# Altium project DeltaX_basketball_mikro.PrjPcb
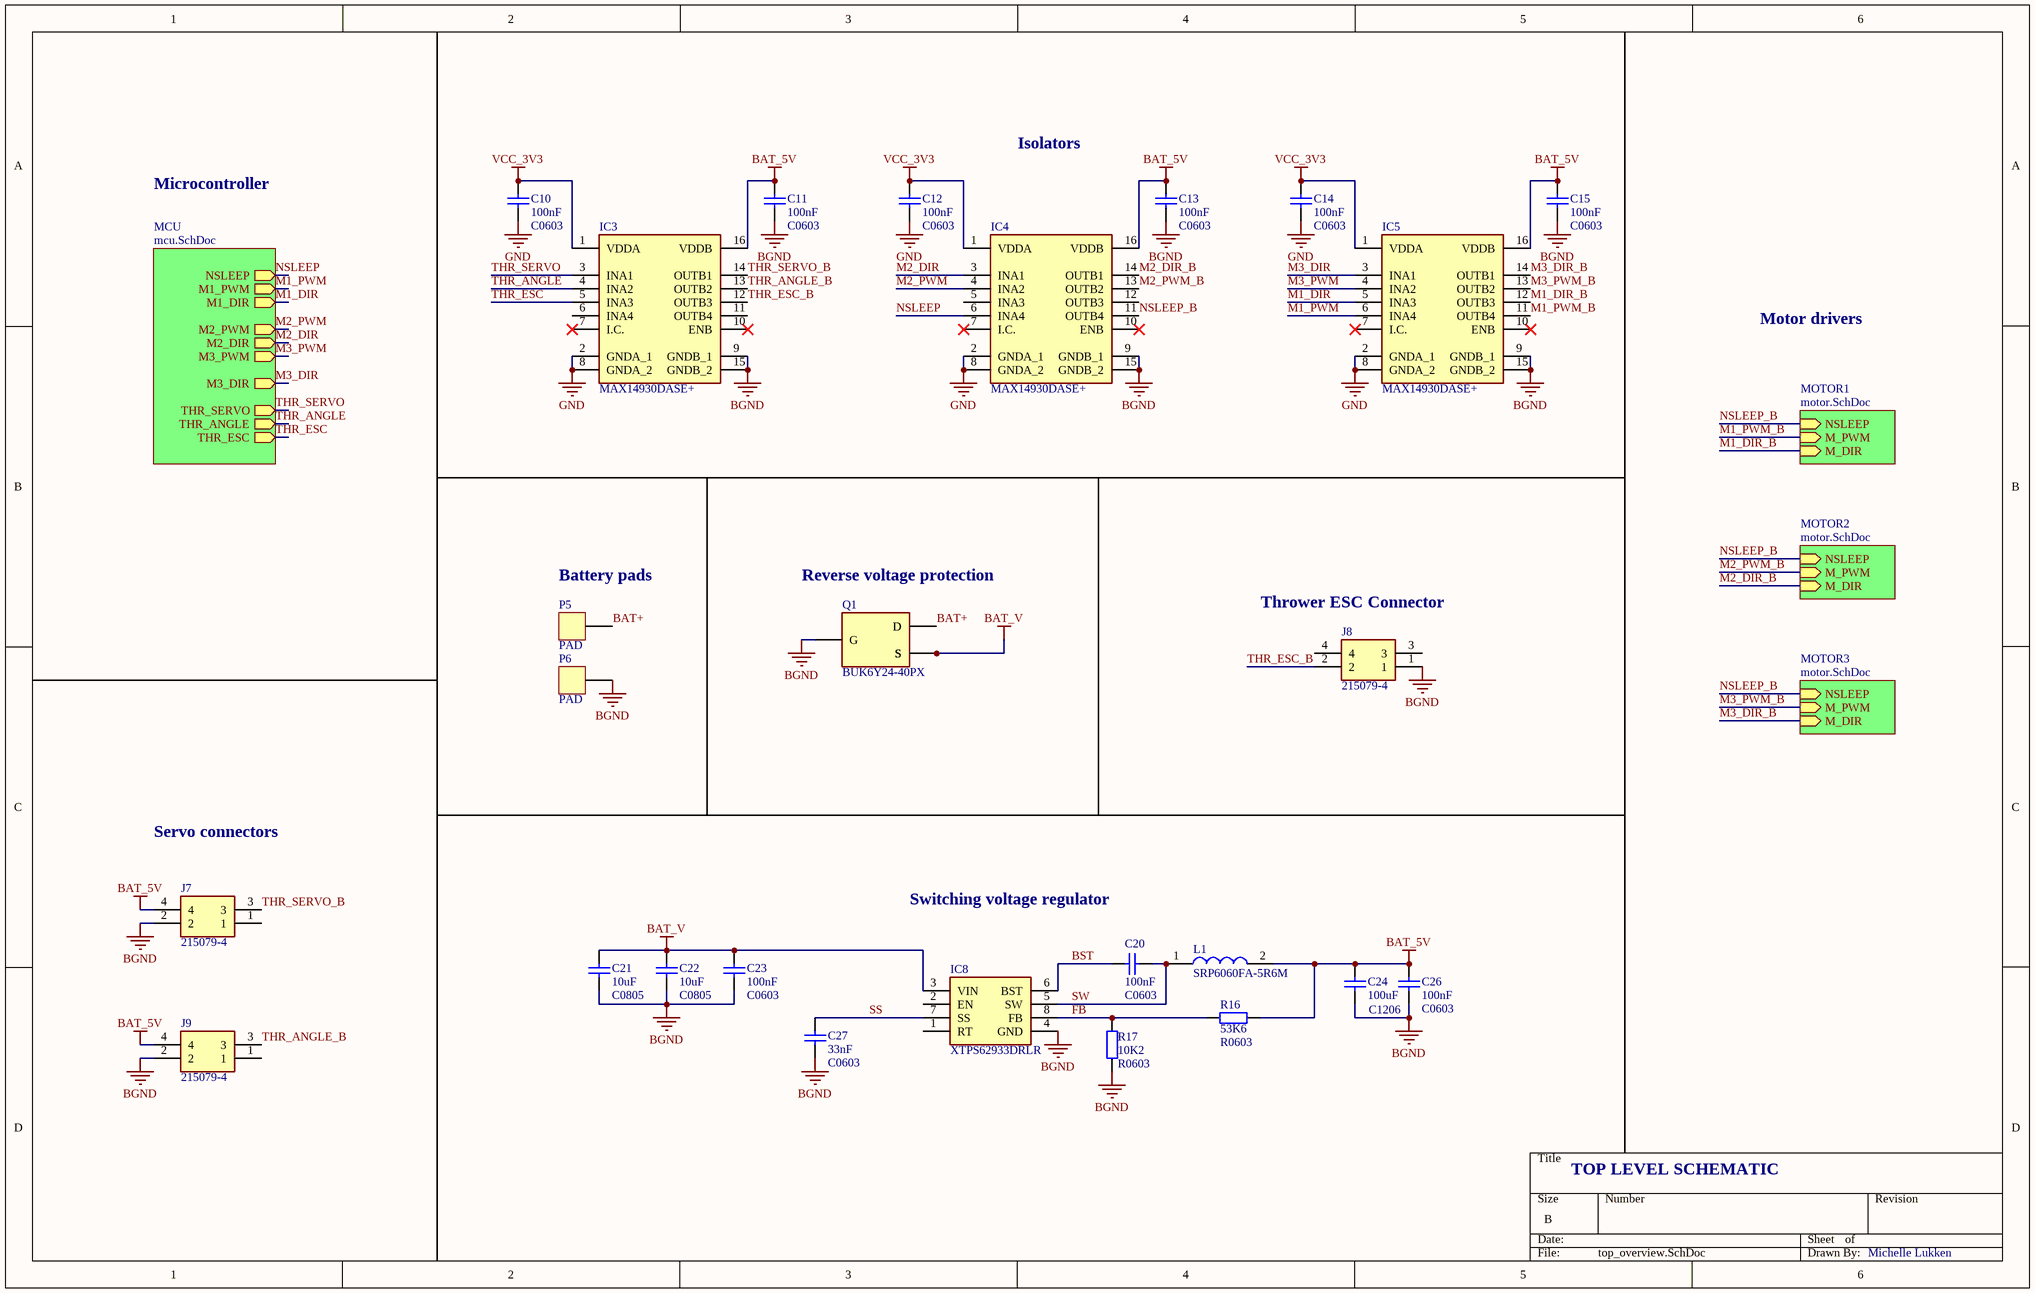
[diagram p0: top_overview.SchDoc]
3 sheets, 89 parts. Net scope: hierarchical (ports join the sheet entries above them; power ports are global).
Board file: mainboard_and_motor_driver_pcb_mu.PcbDoc
Sheets:
  top_overview.SchDoc
    MCU = mcu.SchDoc
    MOTOR1 = motor.SchDoc
    MOTOR2 = motor.SchDoc
    MOTOR3 = motor.SchDoc

## Sheet top_overview.SchDoc
size B; SheetNumber: 1; SheetTotal: 3

### Parts
C10  Capacitance: 100nF  [C0603]
C11  Capacitance: 100nF  [C0603]
C12  Capacitance: 100nF  [C0603]
C13  Capacitance: 100nF  [C0603]
C14  Capacitance: 100nF  [C0603]
C15  Capacitance: 100nF  [C0603]
C20  Capacitance: 100nF  [C0603]
C21  Capacitance: 10uF  [C0805]
C22  Capacitance: 10uF  [C0805]
C23  Capacitance: 100nF  [C0603]
C24  Capacitance: 100uF  [C1206]
C26  Capacitance: 100nF  [C0603]
C27  Capacitance: 33nF  [C0603]
IC3  MAX14930DASE+  [SOIC127P600X175-16N]
IC4  MAX14930DASE+  [SOIC127P600X175-16N]
IC5  MAX14930DASE+  [SOIC127P600X175-16N]
IC8  XTPS62933DRLR  [SOTFL50P160X60-8N]
J7  215079-4  [2150794]
J8  215079-4  [2150794]
J9  215079-4  [2150794]
L1  SRP6060FA-5R6M  [SRP6060FA5R6M]
P5  PAD  [BIG_PAD]
P6  PAD  [BIG_PAD]
Q1  BUK6Y24-40PX  [BUK6Y2440PX]
R16  53K6  [R0603]
R17  10K2  [R0603]

### Sub-sheets
MCU = mcu.SchDoc: M2_DIR (out), M3_PWM (out), M1_PWM (out), M2_PWM (out), M3_DIR (out), M1_DIR (out), NSLEEP (out), THR_SERVO (out), THR_ANGLE (out), THR_ESC (out)
MOTOR1 = motor.SchDoc: NSLEEP (in), M_PWM (in), M_DIR (in)
MOTOR2 = motor.SchDoc: NSLEEP (in), M_PWM (in), M_DIR (in)
MOTOR3 = motor.SchDoc: NSLEEP (in), M_PWM (in), M_DIR (in)

### Nets
BAT_5V: C11.2 C13.2 C15.2 C24.1 C26.1 IC3.16(VDDB) IC4.16(VDDB) IC5.16(VDDB) J7.4 J9.4 L1.2 R16.2
BAT_V: C21.2 C22.2 C23.2 IC8.3(VIN) Q1.1(S) Q1.2(S) Q1.3(S)
BGND: C11.1 C13.1 C15.1 C21.1 C22.1 C23.1 C24.2 C26.2 C27.1 IC3.9(GNDB_1) IC3.15(GNDB_2) IC4.9(GNDB_1) IC4.15(GNDB_2) IC5.9(GNDB_1) IC5.15(GNDB_2) IC8.4(GND) J7.2 J8.1 J9.2 P6.1(PAD) Q1.4(G) R17.2
GND: C10.1 C12.1 C14.1 IC3.2(GNDA_1) IC3.8(GNDA_2) IC4.2(GNDA_1) IC4.8(GNDA_2) IC5.2(GNDA_1) IC5.8(GNDA_2)
VCC_3V3: C10.2 C12.2 C14.2 IC3.1(VDDA) IC4.1(VDDA) IC5.1(VDDA)
BAT+: P5.1(PAD) Q1.5(D) Q1.6(D)
BST: C20.2 IC8.6(BST)
FB: IC8.8(FB) R16.1 R17.1
M1_DIR: IC5.5(INA3) ; sheet MCU/M1_DIR
M1_DIR_B: IC5.12(OUTB3) ; sheet MOTOR1/M_DIR
M1_PWM: IC5.6(INA4) ; sheet MCU/M1_PWM
M1_PWM_B: IC5.11(OUTB4) ; sheet MOTOR1/M_PWM
M2_DIR: IC4.3(INA1) ; sheet MCU/M2_DIR
M2_DIR_B: IC4.14(OUTB1) ; sheet MOTOR2/M_DIR
M2_PWM: IC4.4(INA2) ; sheet MCU/M2_PWM
M2_PWM_B: IC4.13(OUTB2) ; sheet MOTOR2/M_PWM
M3_DIR: IC5.3(INA1) ; sheet MCU/M3_DIR
M3_DIR_B: IC5.14(OUTB1) ; sheet MOTOR3/M_DIR
M3_PWM: IC5.4(INA2) ; sheet MCU/M3_PWM
M3_PWM_B: IC5.13(OUTB2) ; sheet MOTOR3/M_PWM
NSLEEP: IC4.6(INA4) ; sheet MCU/NSLEEP
NSLEEP_B: IC4.11(OUTB4) ; sheet MOTOR1/NSLEEP, sheet MOTOR2/NSLEEP, sheet MOTOR3/NSLEEP
SS: C27.2 IC8.7(SS)
SW: C20.1 IC8.5(SW) L1.1
THR_ANGLE: IC3.4(INA2) ; sheet MCU/THR_ANGLE
THR_ANGLE_B: IC3.13(OUTB2) J9.3
THR_ESC: IC3.5(INA3) ; sheet MCU/THR_ESC
THR_ESC_B: IC3.12(OUTB3) J8.2
THR_SERVO: IC3.3(INA1) ; sheet MCU/THR_SERVO
THR_SERVO_B: IC3.14(OUTB1) J7.3

Not connected (* = marked no-connect by the designer): IC3 6(INA4) 7(I.C.)* 10(ENB)* 11(OUTB4); IC4 5(INA3) 7(I.C.)* 10(ENB)* 12(OUTB3); IC5 7(I.C.)* 10(ENB)*; IC8 1(RT) 2(EN); J7 1; J8 3 4; J9 1

### Notes on the sheet
- Isolators
- Microcontroller
- Motor drivers
- (near P5) Battery pads
- (near Q1) Reverse voltage protection
- (near J8) Thrower ESC Connector
- Servo connectors
- Switching voltage regulator
- TOP LEVEL SCHEMATIC
- Michelle Lukken

### Library data of the parts
C10-C15 C20-C24 C26 C27 = Capacitor: Ceramic capacitor; Type: MLCC; Voltage rating: *V; ComponentLinknDescription: Datasheet; Characteristic: *; Manufacturer: *; ComponentLinknURL: *
  C10-C15 C20 C23 C26 C27: Note: C0603
  C21 C22: Note: C0805
  C24: Note: C1206
IC3-IC5 = MAX14930DASE+: Integrated Circuit; Manufacturer_Name: Maxim Integrated; Manufacturer_Part_Number: MAX14930EASE+; Datasheet Link: https://datasheets.maximintegrated.com/en/ds/MAX14130-MAX14932.pdf; Height: 1.75mm; Mouser Part Number: 700-MAX14930EASE+; Mouser Price/Stock: https://www.mouser.co.uk/ProductDetail/Maxim-Integrated/MAX14930EASE%2b?qs=AAveGqk956E0OaZbIR%2FI4w%3D%3D
IC8 = XTPS62933DRLR: Integrated Circuit; Manufacturer_Name: Texas Instruments; Datasheet Link: https://www.ti.com/lit/ds/symlink/tps62933.pdf?ts=1626073394234; Height: 0.6mm; Manufacturer_Part_Number: TPS62933DRLR; Mouser Part Number: 595-TPS62933DRLR; Mouser Price/Stock: https://www.mouser.co.uk/ProductDetail/Texas-Instruments/TPS62933DRLR?qs=Rp5uXu7WBW9fv47wfQVntQ%3D%3D; Arrow Part Number: TPS62933DRLR; Arrow Price/Stock: https://www.arrow.com/en/products/tps62933drlr/texas-instruments?region=nac
J7-J9 = 215079-4: Connector; Manufacturer_Name: TE Connectivity; Datasheet Link: https://www.te.com/commerce/DocumentDelivery/DDEController?Action=srchrtrv&DocNm=215079&DocType=Customer+Drawing&DocLang=English; Height: 4.2mm; Manufacturer_Part_Number: 215079-4; Mouser Part Number: 571-215079-4; Mouser Price/Stock: https://www.mouser.co.uk/ProductDetail/TE-Connectivity/215079-4?qs=O3N86PA0UL%252BdoZEVcFx8sQ%3D%3D; Arrow Part Number: 215079-4; Arrow Price/Stock: https://www.arrow.com/en/products/215079-4/te-connectivity
L1 = SRP6060FA-5R6M: Inductor; Manufacturer_Name: Bourns; Datasheet Link: https://www.bourns.com/docs/Product-Datasheets/SRP6060FA.pdf; Height: 6mm; Manufacturer_Part_Number: SRP6060FA-5R6M; Mouser Part Number: 652-SRP6060FA-5R6M; Mouser Price/Stock: https://www.mouser.co.uk/ProductDetail/Bourns/SRP6060FA-5R6M?qs=MLItCLRbWsxLUQxbwaGgMA%3D%3D; Arrow Part Number: SRP6060FA-5R6M; Arrow Price/Stock: https://www.arrow.com/en/products/srp6060fa-5r6m/bourns?region=nac
Q1 = BUK6Y24-40PX: MOSFET (P-Channel); Manufacturer_Name: Nexperia; Datasheet Link: https://assets.nexperia.com/documents/data-sheet/BUK6Y24-40P.pdf; Height: 1.2mm; Manufacturer_Part_Number: BUK6Y24-40PX; Mouser Part Number: 771-BUK6Y24-40PX; Mouser Price/Stock: https://www.mouser.co.uk/ProductDetail/Nexperia/BUK6Y24-40PX?qs=vmHwEFxEFR8tyd2WwTEwBg%3D%3D; Arrow Part Number: BUK6Y24-40PX; Arrow Price/Stock: https://www.arrow.com/en/products/buk6y24-40px/nexperia?region=nac
R16 R17 = Resistor: Precision: *%; Voltage rating: *V; Temp coefficient: *ppm; Power rating: *mW; ComponentLinknDescription: Datasheet; Manufacturer: *; ComponentLinknURL: *; Note: R0603
  R16: Resistance: 53K6
  R17: Resistance: 10K2

## Sheet mcu.SchDoc
size A; SheetNumber: 2; SheetTotal: 3; SPICEModelCacheWLBWUGVA: <root> / <DocumentId>WLBWUGVA</DocumentId> / </root>
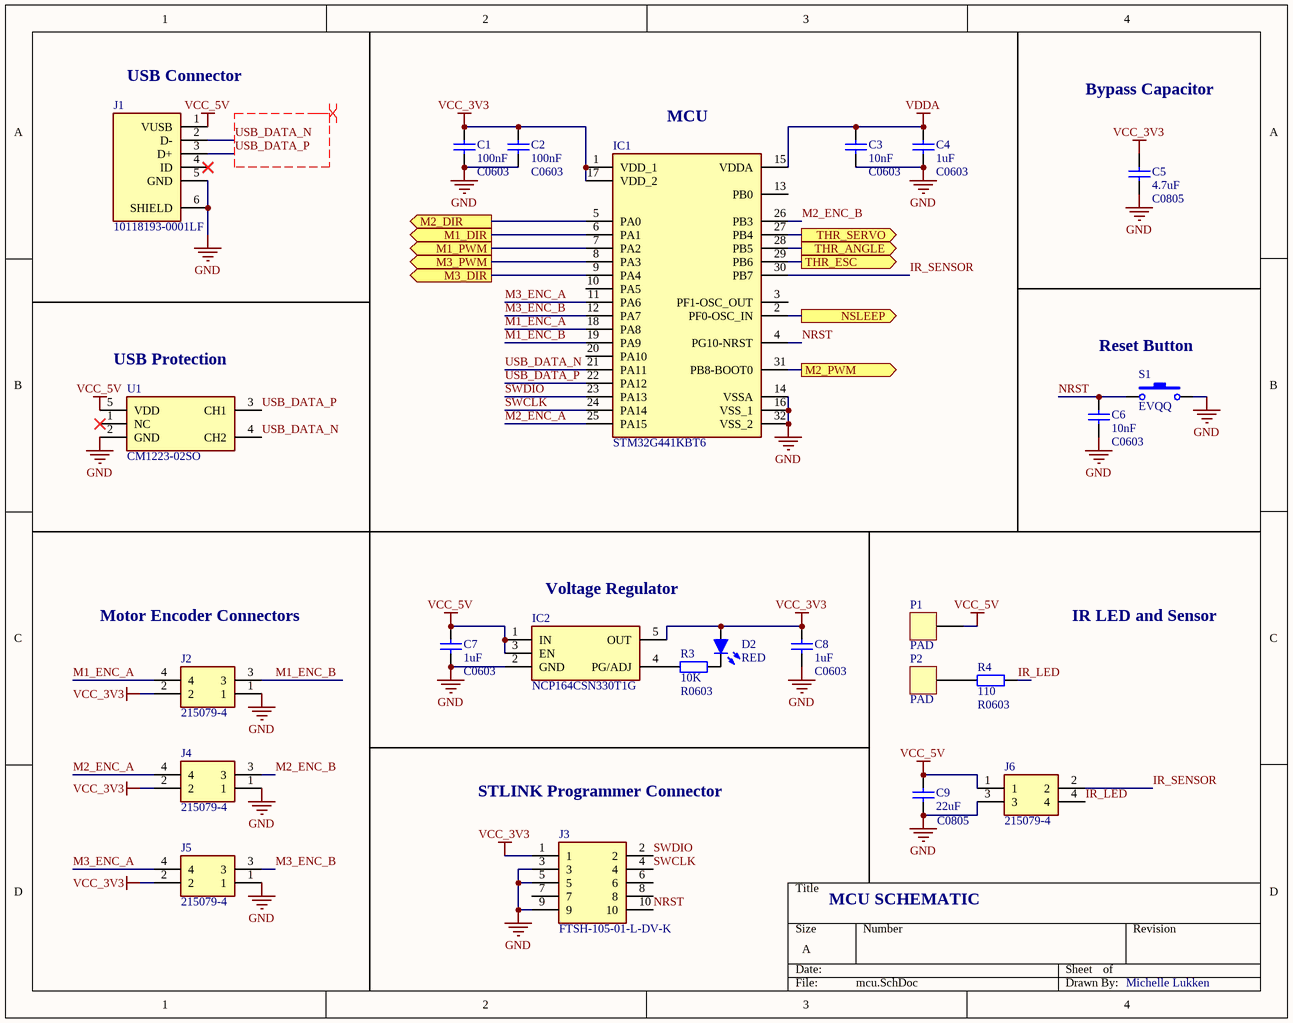
[diagram p1: mcu.SchDoc]

### Parts
C1  Capacitance: 100nF  [C0603]
C2  Capacitance: 100nF  [C0603]
C3  Capacitance: 10nF  [C0603]
C4  Capacitance: 1uF  [C0603]
C5  Capacitance: 4.7uF  [C0805]
C6  Capacitance: 10nF  [C0603]
C7  Capacitance: 1uF  [C0603]
C8  Capacitance: 1uF  [C0603]
C9  Capacitance: 22uF  [C0805]
D2  Colour: RED  [LED_0603]  (hidden comment: LED)
IC1  STM32G441KBT6  [QFP80P900X900X160-32N]
IC2  NCP164CSN330T1G  [SOT95P275X110-5N]
J1  10118193-0001LF  [101181930001LF]
J2  215079-4  [2150794]
J3  FTSH-105-01-L-DV-K  [FTSH10501LDVK]
J4  215079-4  [2150794]
J5  215079-4  [2150794]
J6  215079-4  [2150794]
P1  PAD  [PAD]
P2  PAD  [PAD]
R3  10K  [R0603]
R4  110  [R0603]
S1  EVQQ  [EVQQ]
U1  CM1223-02SO  [SOT95P280X145-5N]

### Ports
M1_DIR (out, see top_overview[1A]), M1_PWM (out, see top_overview[1A]), M2_DIR (out, see top_overview[1B]), M2_PWM (out, see top_overview[1B]), M3_DIR (out, see top_overview[1B]), M3_PWM (out, see top_overview[1B]), NSLEEP (out, see top_overview[1A]), THR_ANGLE (out, see top_overview[1B]), THR_ESC (out, see top_overview[1B]), THR_SERVO (out, see top_overview[1B])

### Nets
GND: C1.1 C2.1 C3.1 C4.1 C5.1 C6.1 C7.1 C8.1 C9.2 IC1.14(VSSA) IC1.16(VSS_1) IC1.32(VSS_2) IC2.2(GND) J1.5(GND) J1.6(SHIELD) J2.1 J3.3 J3.5 J3.9 J4.1 J5.1 J6.3 S1.2 U1.2(GND)
VCC_3V3: C1.2 C2.2 C5.2 C8.2 D2.1(A) IC1.1(VDD_1) IC1.17(VDD_2) IC2.5(OUT) J2.2 J3.1 J4.2 J5.2
VCC_5V: C7.2 C9.1 IC2.1(IN) IC2.3(EN) J1.1(VUSB) J6.1 P1.1(PAD) U1.5(VDD)
VDDA: C3.2 C4.2 IC1.15(VDDA)
IR_LED: J6.4 R4.2
IR_SENSOR: IC1.30(PB7) J6.2
M1_DIR: IC1.6(PA1) ; port M1_DIR
M1_ENC_A: IC1.18(PA8) J2.4
M1_ENC_B: IC1.19(PA9) J2.3
M1_PWM: IC1.7(PA2) ; port M1_PWM
M2_DIR: IC1.5(PA0) ; port M2_DIR
M2_ENC_A: IC1.25(PA15) J4.4
M2_ENC_B: IC1.26(PB3) J4.3
M2_PWM: IC1.31(PB8-BOOT0) ; port M2_PWM
M3_DIR: IC1.9(PA4) ; port M3_DIR
M3_ENC_A: IC1.11(PA6) J5.4
M3_ENC_B: IC1.12(PA7) J5.3
M3_PWM: IC1.8(PA3) ; port M3_PWM
NRST: C6.2 IC1.4(PG10-NRST) J3.10 S1.1
NSLEEP: IC1.2(PF0-OSC_IN) ; port NSLEEP
SWCLK: IC1.24(PA14) J3.4
SWDIO: IC1.23(PA13) J3.2
THR_ANGLE: IC1.28(PB5) ; port THR_ANGLE
THR_ESC: IC1.29(PB6) ; port THR_ESC
THR_SERVO: IC1.27(PB4) ; port THR_SERVO
USB_DATA_N: IC1.21(PA11) J1.2(D-) U1.4(CH2)
USB_DATA_P: IC1.22(PA12) J1.3(D+) U1.3(CH1)
NetD2_2: D2.2(K) R3.1
NetIC2_4: IC2.4(PG/ADJ) R3.2
NetP2_1: P2.1(PAD) R4.1

Not connected (* = marked no-connect by the designer): IC1 3(PF1-OSC_OUT) 10(PA5) 13(PB0) 20(PA10); J1 4(ID)*; J3 6 7 8; U1 1(NC)*

### Layout directives
differential pair; differential pair class USB: USB_DATA_N, USB_DATA_P

### Notes on the sheet
- (near J1) USB Connector
- Bypass Capacitor
- (near IC1) MCU
- (near U1) USB Protection
- Reset Button
- Motor Encoder Connectors
- Voltage Regulator
- IR LED and Sensor
- STLINK Programmer Connector
- MCU SCHEMATIC
- Michelle Lukken

### Library data of the parts
C1-C9 = Capacitor: as C10 on sheet top_overview; Characteristic: *; Manufacturer: *; ComponentLinknURL: *
  C1-C4 C6-C8: Note: C0603
  C5 C9: Note: C0805
D2 = LED: Light Emitting Diode; ComponentLinknDescription: Datasheet; Space heritage: false; Current rating: *mA; Power dissipation: false; Drawn by: *
IC1 = STM32G441KBT6: Integrated Circuit; Manufacturer_Name: STMicroelectronics; Datasheet Link: https://www.st.com/resource/en/datasheet/stm32g441cb.pdf; Height: 1.6mm; Manufacturer_Part_Number: STM32G441KBT6; Mouser Part Number: 511-STM32G441KBT6; Mouser Price/Stock: https://www.mouser.co.uk/ProductDetail/STMicroelectronics/STM32G441KBT6?qs=uwxL4vQweFMT5Uxfs2PTag%3D%3D
IC2 = NCP164CSN330T1G: Integrated Circuit; Manufacturer_Name: onsemi; Datasheet Link: https://componentsearchengine.com/Datasheets/2/NCP164CSN330T1G.pdf; Height: 1.1mm; Manufacturer_Part_Number: NCP164CSN330T1G; Mouser Part Number: 863-NCP164CSN330T1G; Mouser Price/Stock: https://www.mouser.co.uk/ProductDetail/onsemi/NCP164CSN330T1G?qs=xZ%2FP%252Ba9zWqbi%2FAyy5UtoRw%3D%3D; Arrow Part Number: NCP164CSN330T1G; Arrow Price/Stock: https://www.arrow.com/en/products/ncp164csn330t1g/on-semiconductor?region=nac
J1 = 10118193-0001LF: Connector; Manufacturer_Name: AMPHENOL COMMUNICATION SOLUTIONS; Datasheet Link: https://cdn.amphenol-icc.com/media/wysiwyg/files/drawing/10118193.pdf; Height: 3.3mm; Manufacturer_Part_Number: 10118193-0001LF
J2 J4-J6 = 215079-4: as J7 on sheet top_overview; Datasheet Link: https://www.te.com/commerce/DocumentDelivery/DDEController?Action=srchrtrv&DocNm=215079&DocType=Customer+Drawing&DocLang=English; Height: 4.2mm; Manufacturer_Part_Number: 215079-4; Mouser Part Number: 571-215079-4; Mouser Price/Stock: https://www.mouser.co.uk/ProductDetail/TE-Connectivity/215079-4?qs=O3N86PA0UL%252BdoZEVcFx8sQ%3D%3D; Arrow Part Number: 215079-4; Arrow Price/Stock: https://www.arrow.com/en/products/215079-4/te-connectivity
J3 = FTSH-105-01-L-DV-K: Connector; Manufacturer_Name: SAMTEC; Datasheet Link: https://www.arrow.com/en/products/ftsh-105-01-l-dv-k/samtec; Height: 6.1mm; Manufacturer_Part_Number: FTSH-105-01-L-DV-K; Mouser Part Number: 200-FTSH10501LDVK; Mouser Price/Stock: https://www.mouser.co.uk/ProductDetail/Samtec/FTSH-105-01-L-DV-K?qs=%252B5JSS813miOqo3Vy%252BvhCFg%3D%3D; Arrow Part Number: FTSH-105-01-L-DV-K; Arrow Price/Stock: https://www.arrow.com/en/products/ftsh-105-01-l-dv-k/samtec?region=europe
R3 R4 = Resistor: as R16 on sheet top_overview; Manufacturer: *; ComponentLinknURL: *; Note: R0603
  R3: Resistance: 10K
  R4: Resistance: 110
S1 = EVQQ: Switch; Manufacturer: Panasonic; ComponentLinknDescription: Datasheet; Space heritage: false; Drawn by: Erik Ilbis; Verified: false; Part number: EVQQ
U1 = CM1223-02SO: TVS diodes 2-ch; Manufacturer_Name: Texas Instruments; Manufacturer_Part_Number: INA139NA; Datasheet Link: https://componentsearchengine.com/Datasheets/2/INA139NA.pdf; Height: 1.45mm

## Sheet motor.SchDoc
size A; SheetNumber: 3; SheetTotal: 3; SPICEModelCacheKFHQGXDF: <root> / <DocumentId>KFHQGXDF</DocumentId> / </root>
Used 3 times, as channels MOTOR1, MOTOR2, MOTOR3. Parts and nets are listed once, with the designators drawn on the sheet.
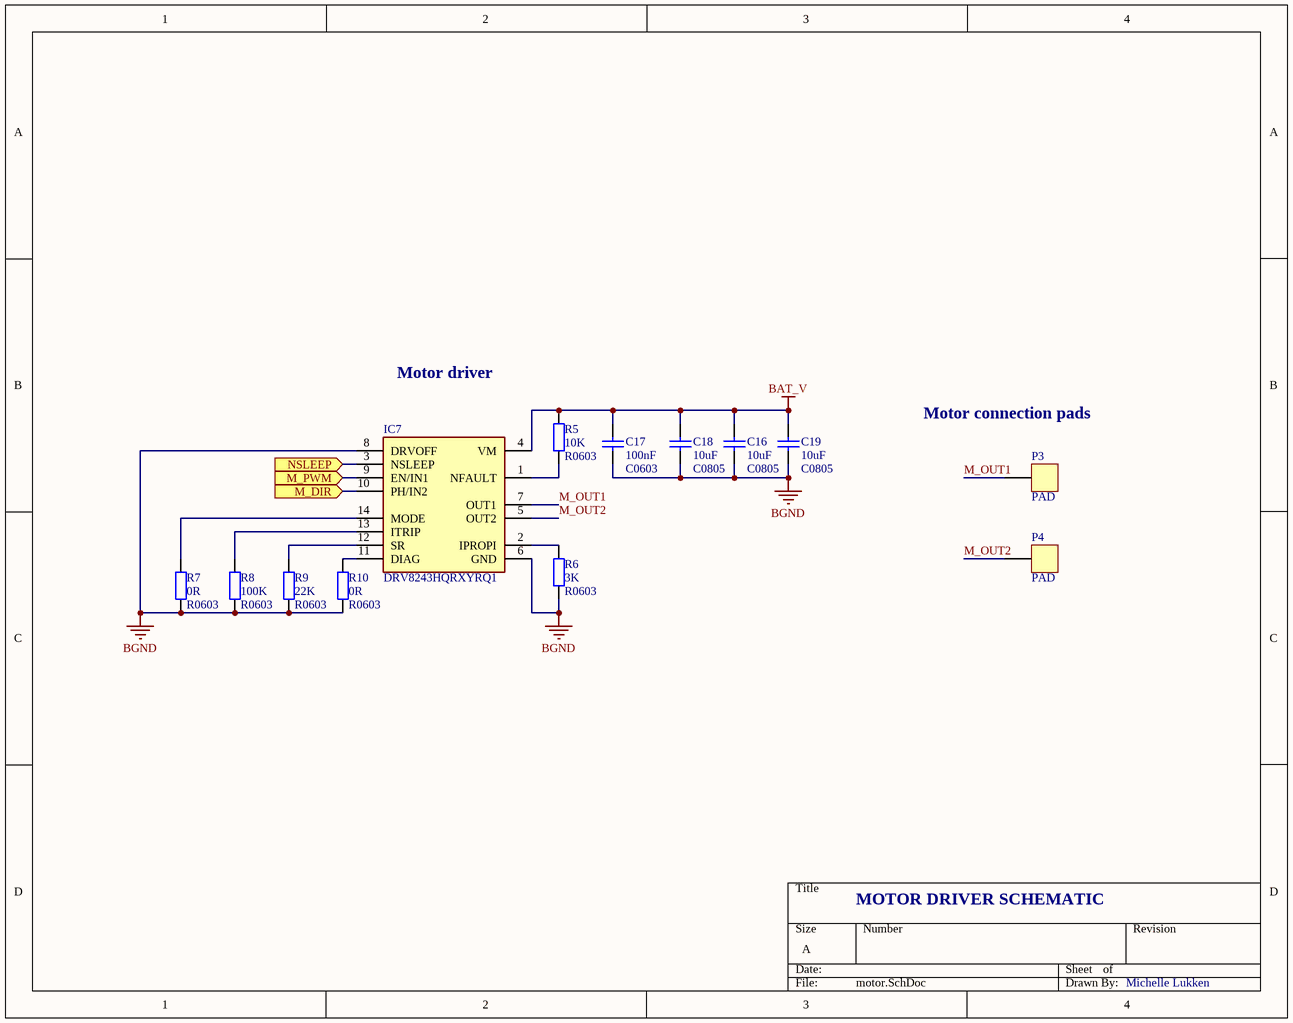
[diagram p2: motor.SchDoc]

### Parts
C16  Capacitance: 10uF  [C0805]
C17  Capacitance: 100nF  [C0603]
C18  Capacitance: 10uF  [C0805]
C19  Capacitance: 10uF  [C0805]
IC7  DRV8243HQRXYRQ1  [DRV8243HQRXYRQ1]
P3  PAD  [PAD]
P4  PAD  [PAD]
R5  10K  [R0603]
R6  3K  [R0603]
R7  0R  [R0603]
R8  100K  [R0603]
R9  22K  [R0603]
R10  0R  [R0603]

### Ports
M_DIR (in, see top_overview[6B]), M_PWM (in, see top_overview[6B]), NSLEEP (in, see top_overview[6B])

### Nets
BAT_V: C16.2 C17.2 C18.2 C19.2 IC7.4(VM) R5.2
BGND: C16.1 C17.1 C18.1 C19.1 IC7.6(GND) IC7.8(DRVOFF) R6.1 R7.1 R8.1 R9.1 R10.1
M_DIR: IC7.10(PH/IN2) ; port M_DIR
M_OUT1: IC7.7(OUT1) P3.1(PAD)
M_OUT2: IC7.5(OUT2) P4.1(PAD)
M_PWM: IC7.9(EN/IN1) ; port M_PWM
NSLEEP: IC7.3(NSLEEP) ; port NSLEEP
NetIC7_1: IC7.1(NFAULT) R5.1
NetIC7_2: IC7.2(IPROPI) R6.2
NetIC7_11: IC7.11(DIAG) R10.2
NetIC7_12: IC7.12(SR) R9.2
NetIC7_13: IC7.13(ITRIP) R8.2
NetIC7_14: IC7.14(MODE) R7.2

### Channels
MOTOR1: designators end in _MOTOR1; ports M_DIR=M1_DIR_B M_PWM=M1_PWM_B NSLEEP=NSLEEP_B
MOTOR2: designators end in _MOTOR2; ports M_DIR=M2_DIR_B M_PWM=M2_PWM_B NSLEEP=NSLEEP_B
MOTOR3: designators end in _MOTOR3; ports M_DIR=M3_DIR_B M_PWM=M3_PWM_B NSLEEP=NSLEEP_B

### Notes on the sheet
- Motor driver
- Motor connection pads
- MOTOR DRIVER SCHEMATIC
- Michelle Lukken

### Library data of the parts
C16-C19 = Capacitor: as C10 on sheet top_overview; Characteristic: *; Manufacturer: *; ComponentLinknURL: *
  C16 C18 C19: Note: C0805
  C17: Note: C0603
IC7 = DRV8243HQRXYRQ1: Integrated Circuit; Manufacturer_Name: Texas Instruments; Datasheet Link: https://www.ti.com/lit/ds/symlink/drv8243-q1.pdf?HQS=dis-mous-null-mousermode-dsf-pf-null-wwe&ts=1659353397059&ref_url=https%253A%252F%252Fwww.mouser.com%252F; Height: 1mm; Manufacturer_Part_Number: DRV8243HQRXYRQ1
R5-R10 = Resistor: as R16 on sheet top_overview; Manufacturer: *; ComponentLinknURL: *; Note: R0603
  R5: Resistance: 10K
  R6: Resistance: 3K
  R7 R10: Resistance: 0R
  R8: Resistance: 100K
  R9: Resistance: 22K

## Nets that join several sheets
BAT_V: top_overview (7 pins), MOTOR1 (6 pins), MOTOR2 (6 pins), MOTOR3 (6 pins)
BGND: top_overview (22 pins), MOTOR1 (11 pins), MOTOR2 (11 pins), MOTOR3 (11 pins)
GND: top_overview (9 pins), mcu (24 pins)
VCC_3V3: top_overview (6 pins), mcu (12 pins)
M1_DIR: top_overview (IC5.5), mcu (IC1.6)
M1_DIR_B: top_overview (IC5.12), MOTOR1 (IC7_MOTOR1.10)
M1_PWM: top_overview (IC5.6), mcu (IC1.7)
M1_PWM_B: top_overview (IC5.11), MOTOR1 (IC7_MOTOR1.9)
M2_DIR: top_overview (IC4.3), mcu (IC1.5)
M2_DIR_B: top_overview (IC4.14), MOTOR2 (IC7_MOTOR2.10)
M2_PWM: top_overview (IC4.4), mcu (IC1.31)
M2_PWM_B: top_overview (IC4.13), MOTOR2 (IC7_MOTOR2.9)
M3_DIR: top_overview (IC5.3), mcu (IC1.9)
M3_DIR_B: top_overview (IC5.14), MOTOR3 (IC7_MOTOR3.10)
M3_PWM: top_overview (IC5.4), mcu (IC1.8)
M3_PWM_B: top_overview (IC5.13), MOTOR3 (IC7_MOTOR3.9)
NSLEEP: top_overview (IC4.6), mcu (IC1.2)
NSLEEP_B: top_overview (IC4.11), MOTOR1 (IC7_MOTOR1.3), MOTOR2 (IC7_MOTOR2.3), MOTOR3 (IC7_MOTOR3.3)
THR_ANGLE: top_overview (IC3.4), mcu (IC1.28)
THR_ESC: top_overview (IC3.5), mcu (IC1.29)
THR_SERVO: top_overview (IC3.3), mcu (IC1.27)